# EAGLE schematic snes layout2 (EAGLE 6.1)
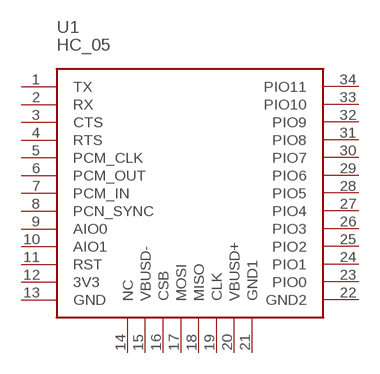
[diagram p0: schematic, sheet 1]

## Parts
U1  HC_05  [BLUETOOTH_SMD]
Unconnected: U1.1(TX) U1.2(RX) U1.3(CTS) U1.4(RTS) U1.5(PCM_CLK) U1.6(PCM_OUT) U1.7(PCM_IN) U1.8(PCN_SYNC) U1.9(AIO0) U1.10(AIO1) U1.11(RST) U1.12(3V3) U1.13(GND) U1.14(NC) U1.15(VBUSD-) U1.16(CSB) U1.17(MOSI) U1.18(MISO) U1.19(CLK) U1.20(VBUSD+) U1.21(GND1) U1.22(GND2) U1.23(PIO0) U1.24(PIO1) U1.25(PIO2) U1.26(PIO3) U1.27(PIO4) U1.28(PIO5) U1.29(PIO6) U1.30(PIO7) U1.31(PIO8) U1.32(PIO9) U1.33(PIO10) U1.34(PIO11)

## Library data of the parts
U1 = BluetoothHC-05:HC_05: HC-05 Bluetooth Module